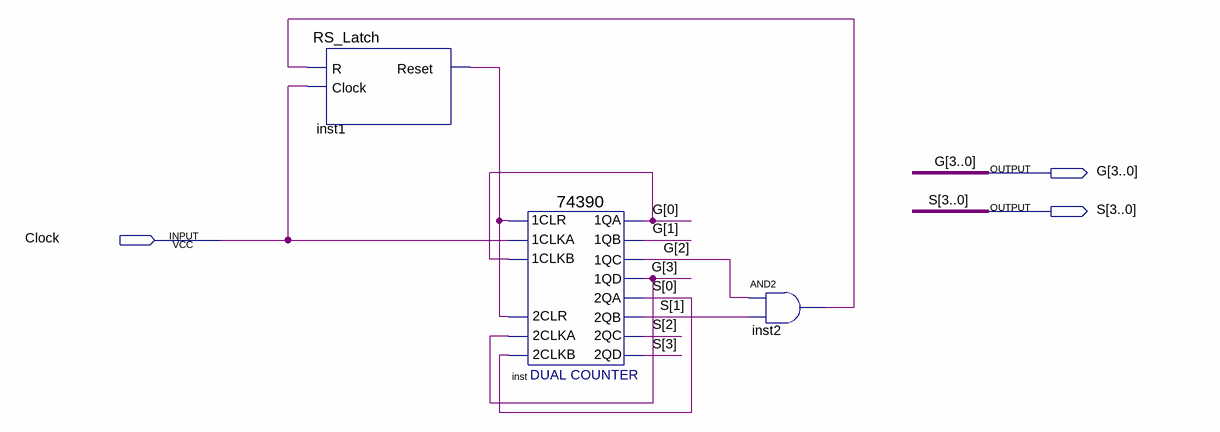
[diagram p0: schematic sheet]
// Quartus schematic Count24.bdf as structural Verilog: 3 symbols, 3 pins
module Count24 (
  input  Clock,
  output [3:0] G,
  output [3:0] S
);

  wire inst1_reset, inst2_out;

  RS_Latch inst1 (.R(inst2_out), .Clock(Clock), .Reset(inst1_reset));
  \74390  inst (
    .\2CLKA (G[3]), .\2CLR (inst1_reset), .\2CLKB (S[0]), .\1CLR (inst1_reset), .\1CLKA (Clock),
    .\1CLKB (G[0]), .\1QA (G[0]), .\1QB (G[1]), .\1QC (G[2]), .\1QD (G[3]), .\2QA (S[0]), .\2QB (S[1]),
    .\2QC (S[2]), .\2QD (S[3]));
  and inst2 (inst2_out, G[2], S[1]);
endmodule
